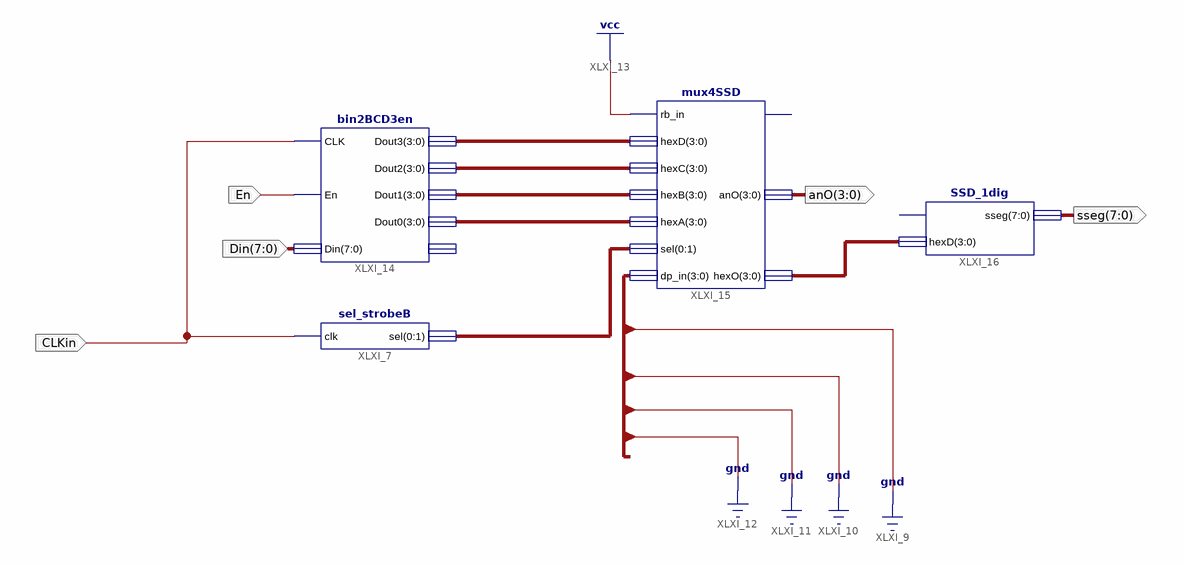
[diagram p0: schematic sheet 1]
// Xilinx ISE schematic lab7_binToBCD_pushdown.sch (spartan3e) as structural Verilog: 4 symbols, 5 ports
module lab7_binToBCD_pushdown (
  input  En,
  input  [7:0] Din,
  input  CLKin,
  output [7:0] sseg,
  output [3:0] anO
);

  wire [1:0] XLXN_15;
  wire [3:0] XLXN_6, XLXN_7, XLXN_8, XLXN_9, XLXN_13;

  sel_strobeB XLXI_7 (.clk(CLKin), .sel({XLXN_15[0], XLXN_15[1]}));
  bin2BCD3en XLXI_14 (
    .CLK(CLKin), .En(En), .Din(Din), .Dout3(XLXN_9), .Dout2(XLXN_8), .Dout1(XLXN_7), .Dout0(XLXN_6));  // open: RBout
  mux4SSD XLXI_15 (
    .rb_in(1'b1), .hexD(XLXN_9), .hexC(XLXN_8), .hexB(XLXN_7), .hexA(XLXN_6), .sel({XLXN_15[0], XLXN_15[1]}),
    .dp_in(4'b0000), .anO(anO), .hexO(XLXN_13));  // open: dpO
  SSD_1dig XLXI_16 (.hexD(XLXN_13), .sseg(sseg));  // open: dp_in
endmodule
